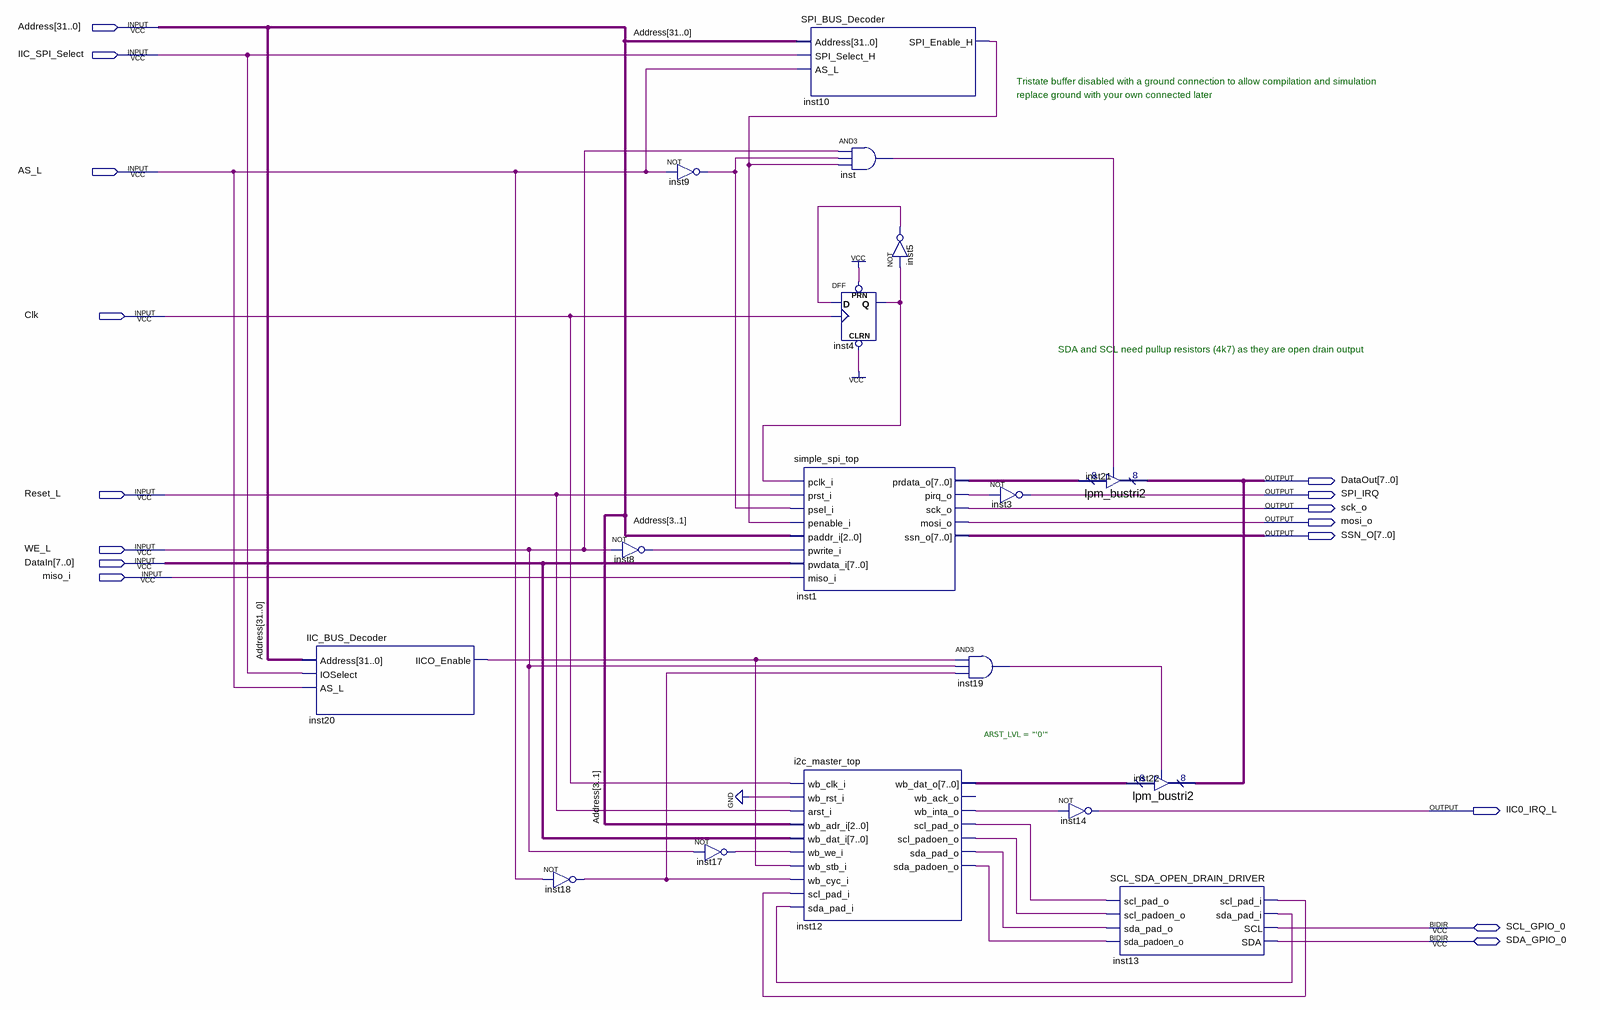
[diagram p0: schematic sheet]
// Quartus schematic IIC_SPI_Interface.bdf as structural Verilog: 17 symbols, 16 pins
module IIC_SPI_Interface (
  input  [31:0] Address,
  input  IIC_SPI_Select,
  input  AS_L,
  input  Clk,
  input  Reset_L,
  input  WE_L,
  input  [7:0] DataIn,
  input  miso_i,
  inout  SCL_GPIO_0,
  inout  SDA_GPIO_0,
  output [7:0] DataOut,
  output SPI_IRQ,
  output sck_o,
  output mosi_o,
  output [7:0] SSN_O,
  output IIC0_IRQ_L
);

  wire inst1_pirq_o, inst4_q, inst5_out, inst8_out, inst9_out, inst10_spi_enable_h, inst12_scl_pad_o,
       inst12_scl_padoen_o, inst12_sda_pad_o, inst12_sda_padoen_o, inst12_wb_inta_o, inst13_scl_pad_i,
       inst13_sda_pad_i, inst17_out, inst18_out, inst19_out, inst20_iico_enable, inst_out;
  wire [7:0] inst1_prdata_o, inst12_wb_dat_o;

  IIC_BUS_Decoder inst20 (.Address(Address), .IOSelect(IIC_SPI_Select), .AS_L(AS_L), .IICO_Enable(inst20_iico_enable));
  not inst18 (inst18_out, AS_L);
  not inst8 (inst8_out, WE_L);
  not inst9 (inst9_out, AS_L);
  not inst17 (inst17_out, WE_L);
  SPI_BUS_Decoder inst10 (
    .Address(Address), .SPI_Select_H(IIC_SPI_Select), .AS_L(AS_L), .SPI_Enable_H(inst10_spi_enable_h));
  simple_spi_top inst1 (
    .pclk_i(inst4_q), .prst_i(Reset_L), .psel_i(inst9_out), .penable_i(inst10_spi_enable_h),
    .paddr_i(Address[3:1]), .pwrite_i(inst8_out), .pwdata_i(DataIn), .miso_i(miso_i),
    .prdata_o(inst1_prdata_o), .pirq_o(inst1_pirq_o), .sck_o(sck_o), .mosi_o(mosi_o), .ssn_o(SSN_O));
  i2c_master_top #(.ARST_LVL("'0'")) inst12 (
    .wb_clk_i(Clk), .wb_rst_i(1'b0), .arst_i(Reset_L), .wb_adr_i(Address[3:1]), .wb_dat_i(DataIn),
    .wb_we_i(inst17_out), .wb_stb_i(inst20_iico_enable), .wb_cyc_i(inst18_out), .scl_pad_i(inst13_scl_pad_i),
    .sda_pad_i(inst13_sda_pad_i), .wb_dat_o(inst12_wb_dat_o), .wb_inta_o(inst12_wb_inta_o),
    .scl_pad_o(inst12_scl_pad_o), .scl_padoen_o(inst12_scl_padoen_o), .sda_pad_o(inst12_sda_pad_o),
    .sda_padoen_o(inst12_sda_padoen_o));  // open: wb_ack_o
  and inst (inst_out, WE_L, inst9_out, inst10_spi_enable_h);
  DFF inst4 (.CLRN(1'b1), .CLK(Clk), .D(inst5_out), .PRN(1'b1), .Q(inst4_q));
  not inst5 (inst5_out, inst4_q);
  not inst3 (SPI_IRQ, inst1_pirq_o);
  and inst19 (inst19_out, inst20_iico_enable, WE_L, inst18_out);
  lpm_bustri2 inst21 (.enabledt(inst_out), .data(inst1_prdata_o), .tridata(DataOut));
  not inst14 (IIC0_IRQ_L, inst12_wb_inta_o);
  lpm_bustri2 inst22 (.enabledt(inst19_out), .data(inst12_wb_dat_o), .tridata(DataOut));
  SCL_SDA_OPEN_DRAIN_DRIVER inst13 (
    .scl_pad_o(inst12_scl_pad_o), .scl_padoen_o(inst12_scl_padoen_o), .sda_pad_o(inst12_sda_pad_o),
    .sda_padoen_o(inst12_sda_padoen_o), .scl_pad_i(inst13_scl_pad_i), .sda_pad_i(inst13_sda_pad_i),
    .SCL(SCL_GPIO_0), .SDA(SDA_GPIO_0));

  // Notes on the sheet:
  //   Tristate buffer disabled with a ground connection to allow compilation and simulation
  //   replace ground with your own connected later
  //   SDA and SCL need pullup resistors (4k7) as they are open drain output
endmodule
